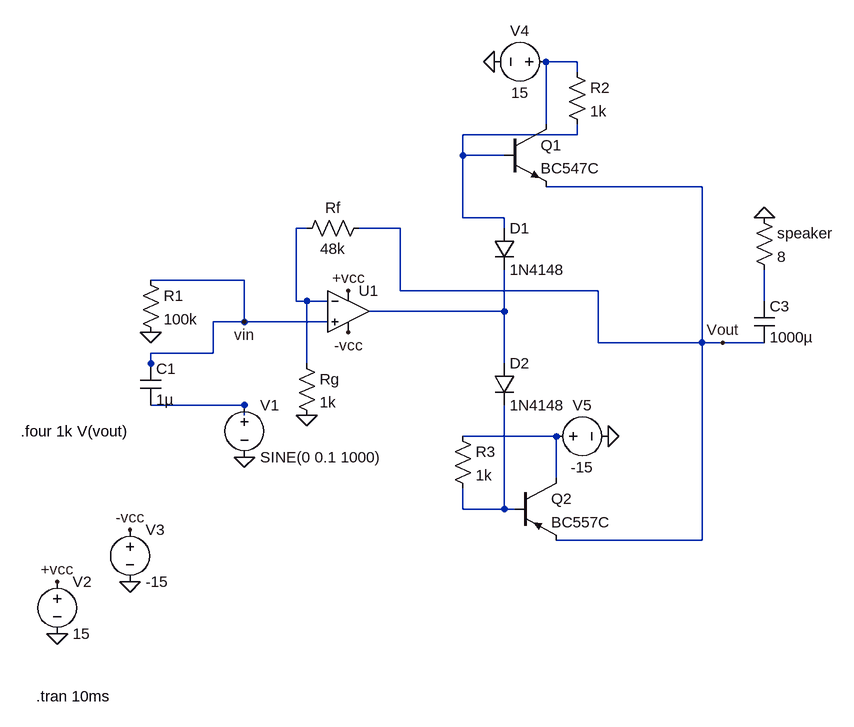
[diagram p0: schematic AB amp_Basic.asc]
AB amp_Basic.asc, the LTspice schematic file:
Version 4.1
SHEET 1 880 680
WIRE 144 -336 96 -336
WIRE 144 -320 144 -336
WIRE 96 -240 96 -336
WIRE 144 -224 144 -240
WIRE 144 -224 -32 -224
WIRE -32 -192 -32 -224
WIRE 32 -192 -32 -192
WIRE 336 -144 96 -144
WIRE -32 -96 -32 -192
WIRE 32 -96 -32 -96
WIRE -272 -80 -288 -80
WIRE -128 -80 -192 -80
WIRE 32 -80 32 -96
WIRE -368 0 -512 0
WIRE -128 16 -128 -80
WIRE 176 16 -128 16
WIRE -288 32 -288 -80
WIRE -272 32 -288 32
WIRE -240 32 -272 32
WIRE 432 32 432 -16
WIRE 32 48 32 -16
WIRE 32 48 -176 48
WIRE -368 64 -368 0
WIRE -368 64 -416 64
WIRE -240 64 -368 64
WIRE 176 96 176 16
WIRE 336 96 336 -144
WIRE 336 96 176 96
WIRE 368 96 336 96
WIRE 432 96 368 96
WIRE -416 112 -416 64
WIRE -416 112 -512 112
WIRE -512 128 -512 112
WIRE -272 128 -272 32
WIRE 32 128 32 48
WIRE -512 144 -512 128
WIRE -368 192 -512 192
WIRE -368 208 -368 192
WIRE 112 240 -32 240
WIRE 112 304 112 240
WIRE -32 352 -32 320
WIRE 32 352 32 192
WIRE 32 352 -32 352
WIRE 48 352 32 352
WIRE 336 400 336 96
WIRE 336 400 112 400
FLAG -544 464 0
FLAG -656 544 0
FLAG -656 464 +vcc
FLAG -208 16 +vcc
FLAG -208 80 -vcc
FLAG -272 208 0
FLAG 16 -336 0
FLAG 192 240 0
FLAG 432 -96 0
FLAG -368 272 0
FLAG -368 64 vin
FLAG -544 384 -vcc
FLAG 368 96 Vout
FLAG -512 80 0
SYMBOL voltage -368 176 R0
WINDOW 123 0 0 Left 0
WINDOW 39 0 0 Left 0
SYMATTR InstName V1
SYMATTR Value SINE(0 0.1 1000)
SYMBOL voltage -656 448 R0
WINDOW 123 0 0 Left 0
WINDOW 39 0 0 Left 0
SYMATTR InstName V2
SYMATTR Value 15
SYMBOL res -288 112 R0
SYMATTR InstName Rg
SYMATTR Value 1k
SYMBOL res -176 -96 R90
WINDOW 0 0 56 VBottom 2
WINDOW 3 32 56 VTop 2
SYMATTR InstName Rf
SYMATTR Value 48k
SYMBOL diode 16 128 R0
SYMATTR InstName D2
SYMATTR Value 1N4148
SYMBOL npn 32 -240 R0
SYMATTR InstName Q1
SYMATTR Value BC547C
SYMBOL pnp 48 304 R0
SYMATTR InstName Q2
SYMATTR Value BC557C
SYMBOL voltage 112 -336 R90
WINDOW 0 -32 56 VBottom 2
WINDOW 3 32 56 VTop 2
WINDOW 123 0 0 Left 0
WINDOW 39 0 0 Left 0
SYMATTR InstName V4
SYMATTR Value 15
SYMBOL res 416 -112 R0
SYMATTR InstName speaker
SYMATTR Value 8
SYMBOL cap -528 128 R0
SYMATTR InstName C1
SYMATTR Value 1µ
SYMBOL res -528 -16 R0
SYMATTR InstName R1
SYMATTR Value 100k
SYMBOL voltage -544 368 R0
WINDOW 123 0 0 Left 0
WINDOW 39 0 0 Left 0
SYMATTR InstName V3
SYMATTR Value -15
SYMBOL voltage 96 240 R270
WINDOW 0 32 56 VTop 2
WINDOW 3 -32 56 VBottom 2
WINDOW 123 0 0 Left 0
WINDOW 39 0 0 Left 0
SYMATTR InstName V5
SYMATTR Value -15
SYMBOL res -48 224 R0
SYMATTR InstName R3
SYMATTR Value 1k
SYMBOL res 128 -336 R0
SYMATTR InstName R2
SYMATTR Value 1k
SYMBOL diode 16 -80 R0
SYMATTR InstName D1
SYMATTR Value 1N4148
SYMBOL cap 416 32 R0
SYMATTR InstName C3
SYMATTR Value 1000µ
SYMBOL OpAmps\\UniversalOpAmp2 -208 48 R0
SYMATTR InstName U1
TEXT -688 640 Left 2 !.tran 10ms
TEXT -712 232 Left 2 !.four 1k V(vout)

The netlist it stands for:
* AB amp_Basic.asc
V1 N006 0 SINE(0 0.1 1000)
V2 +vcc 0 15
Rg N003 0 1k
Rf Vout N003 48k
D2 N005 N008 1N4148
Q1 N001 N002 Vout 0 BC547C
Q2 N007 N008 Vout 0 BC557C
V4 N001 0 15
R§speaker 0 N004 8
C1 vin N006 1µ
R1 vin 0 100k
V3 -vcc 0 -15
V5 N007 0 -15
R3 N007 N008 1k
R2 N001 N002 1k
D1 N002 N005 1N4148
C3 N004 Vout 1000µ
X§U1 vin N003 +vcc -vcc N005 level2 Avol=1Meg GBW=10Meg Slew=10Meg Ilimit=25m Rail=0 Vos=0 En=0 Enk=0 In=0 Ink=0 Rin=500Meg  ; pins In+ In- V+ V- OUT
.model D D
.lib standard.dio
.model NPN NPN
.model PNP PNP
.lib standard.bjt
.tran 10ms
.four 1k V(vout)
.lib UniversalOpAmp2.lib
.backanno
.end